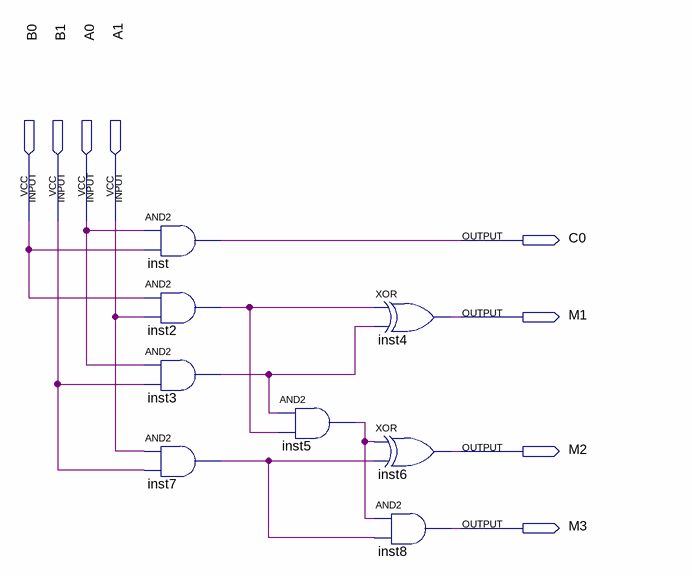
[diagram p0: schematic sheet]
// Quartus schematic q62.bdf as structural Verilog: 8 symbols, 8 pins
module q62 (
  input  B0,
  input  B1,
  input  A0,
  input  A1,
  output C0,
  output M1,
  output M2,
  output M3
);

  wire inst2_out, inst3_out, inst5_out, inst7_out;

  and inst (C0, A0, B0);
  and inst2 (inst2_out, B0, A1);
  and inst3 (inst3_out, A0, B1);
  and inst7 (inst7_out, A1, B1);
  and inst5 (inst5_out, inst3_out, inst2_out);
  xor inst4 (M1, inst2_out, inst3_out);
  xor inst6 (M2, inst5_out, inst7_out);
  and inst8 (M3, inst5_out, inst7_out);
endmodule
